# EAGLE design breakfly_rev2 (EAGLE 5.10)
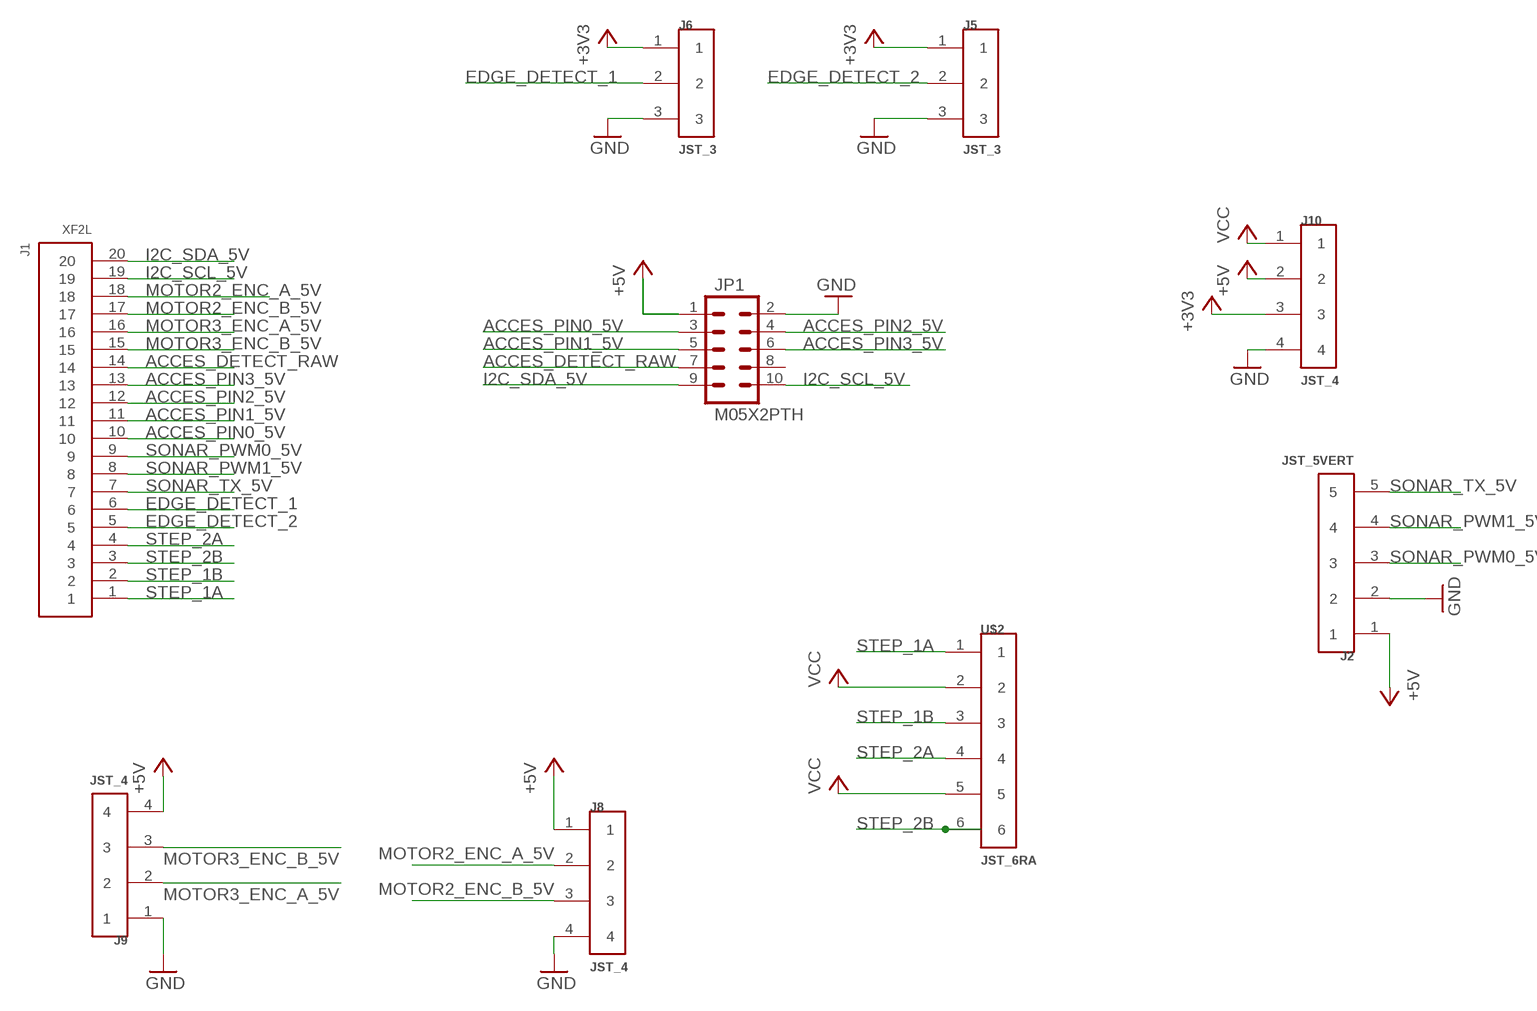
[diagram p0: schematic, sheet 1]

## Parts
J1  XF2L  [OMRON_XF]
J2  JST_5VERT  [JST_ZH_5]
J5  JST_3  [JST_ZH_3]
J6  JST_3  [JST_ZH_3]
J8  JST_4  [JST_ZH_4]
J9  JST_4  [JST_ZH_4]
J10  JST_4  [JST_ZH_4]
JP1  M05X2PTH  [AVR_ICSP]
U$2  JST_6RA  [JST_ZH_RA_6]

## Nets
+3V3: J5.1 J6.1 J10.3
+5V: J2.1 J8.1 J9.4 J10.2 JP1.1
ACCES_DETECT_RAW: J1.14 JP1.7
ACCES_PIN0_5V: J1.10 JP1.3
ACCES_PIN1_5V: J1.11 JP1.5
ACCES_PIN2_5V: J1.12 JP1.4
ACCES_PIN3_5V: J1.13 JP1.6
EDGE_DETECT_1: J1.6 J6.2
EDGE_DETECT_2: J1.5 J5.2
GND: J2.2 J5.3 J6.3 J8.4 J9.1 J10.4 JP1.2
I2C_SCL_5V: J1.19 JP1.10
I2C_SDA_5V: J1.20 JP1.9
MOTOR2_ENC_A_5V: J1.18 J8.2
MOTOR2_ENC_B_5V: J1.17 J8.3
MOTOR3_ENC_A_5V: J1.16 J9.2
MOTOR3_ENC_B_5V: J1.15 J9.3
SONAR_PWM0_5V: J1.9 J2.3
SONAR_PWM1_5V: J1.8 J2.4
SONAR_TX_5V: J1.7 J2.5
STEP_1A: J1.1 U$2.1
STEP_1B: J1.2 U$2.3
STEP_2A: J1.4 U$2.4
STEP_2B: J1.3 U$2.6
VCC: J10.1 U$2.2 U$2.5
Unconnected: JP1.8

## Library data of the parts
J1 = kwoo:XF2L
J2 = kwoo:JST_5
J5 J6 = kwoo:JST_3
J8-J10 = kwoo:JST_4
JP1 = SparkFun:M05X2: Header 5x2 Standard 10-pin dual row 0.1" header. Commonly used with AVR-ISP. Use with Spark Fun Electronics SKU: PRT-00778
U$2 = kwoo:JST_6

## Board
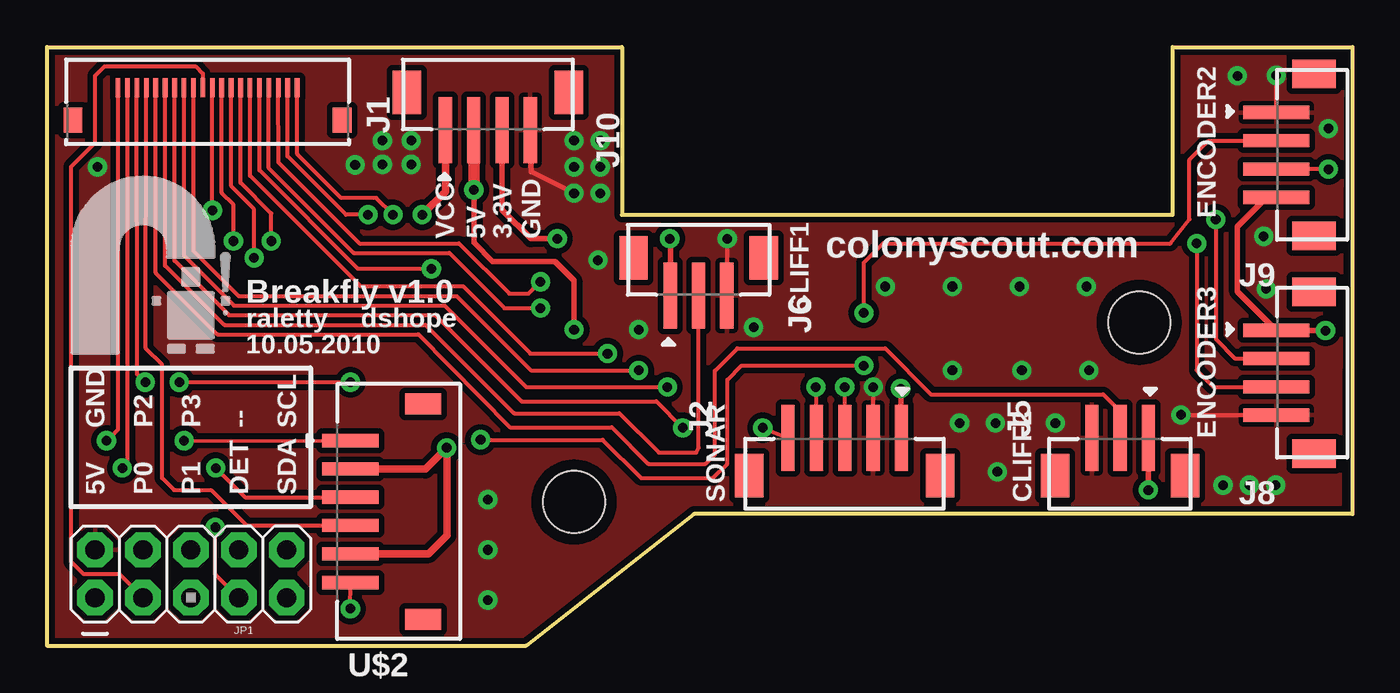
[diagram p1: board, top side]
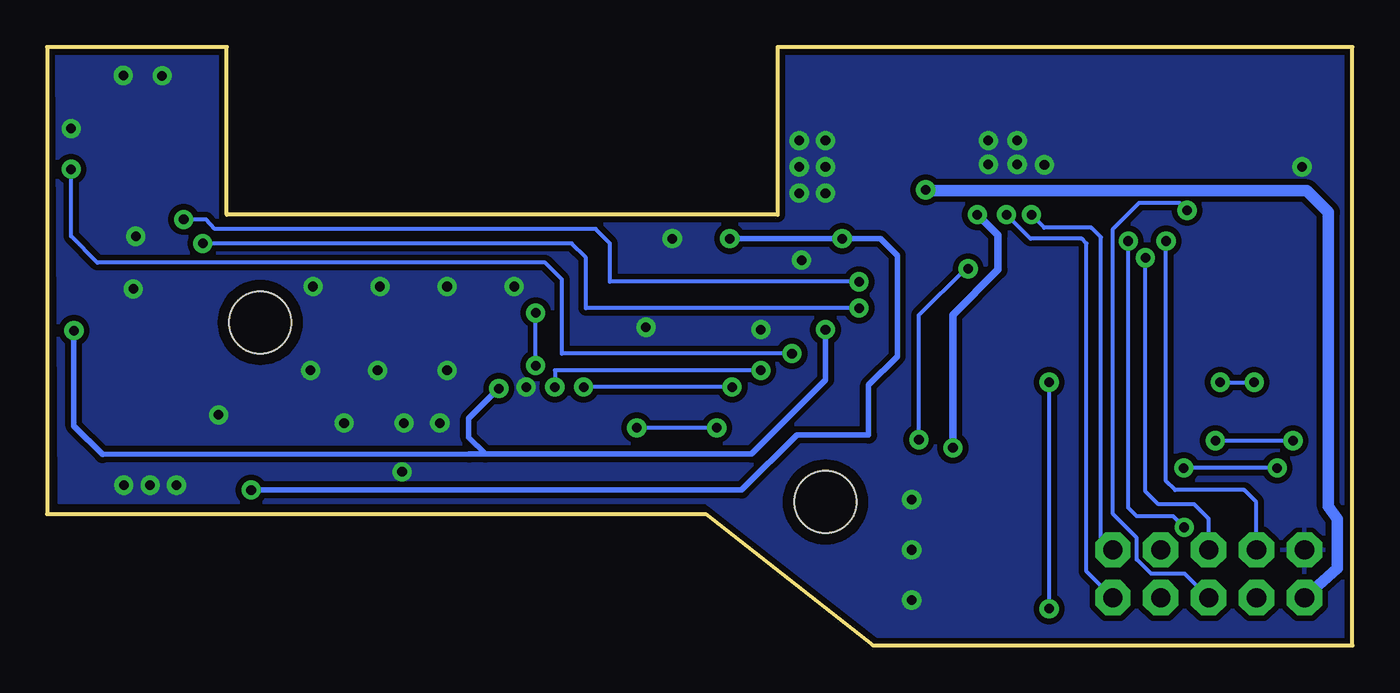
[diagram p2: board, bottom side, seen from below]

Size 69.22 x 31.75 mm. Coordinates in mm from the lower left corner, seen from the top.
Outline: 0,0 0,31.75 30.48,31.75 30.48,22.86 59.69,22.86 59.69,31.75 69.22,31.75 69.22,6.99 34.29,6.99 25.4,0 0,0
Copper layers (1*16): Top 0.035mm / dielectric 1.5mm / Bottom 0.035mm
Design rules "SparkFun": minimum track width 8mil, minimum drill 20mil, track to track 8mil, track to pad 8mil, pad to pad 8mil, via to via 8mil, smd to smd 8mil, copper to edge 10mil, drill to drill 8mil, minimum pad ring 12mil, minimum via ring 10mil, stop-mask expansion 4mil, vias tented up to drill 25mil, thermal gap 10mil

### Footprints (pad centres in the part's own frame; a part is rotated, then mirrored left to right if it is on the bottom)
OMRON_XF = smd 0.25 x 1: 1 -4.75,0; 2 -4.25,0; 3 -3.75,0; 4 -3.25,0; 5 -2.75,0; 6 -2.25,0; 7 -1.75,0; 8 -1.25,0; 9 -0.75,0; 10 -0.25,0; 11 0.25,0; 12 0.75,0; 13 1.25,0; 14 1.75,0; 15 2.25,0; 16 2.75,0; 17 3.25,0; 18 3.75,0; 19 4.25,0; 20 4.75,0 | smd 1 x 1.34: SOLDER_PAD1 -7.14,-1.72; SOLDER_PAD2 7.14,-1.72
JST_ZH_5 = smd 0.7 x 3.5: 1 -3.012,-2.508; 2 -1.512,-2.508; 3 -0.012,-2.508; 4 1.488,-2.508; 5 3.012,-2.508 | smd 1.5 x 2.3: CASE1 -5.062,-0.508; CASE2 5.062,-0.508
JST_ZH_3 = smd 0.7 x 3.5: 1 -1.5,-2; 2 0,-2; 3 1.5,-2 | smd 1.5 x 2.3: CASE1 -3.45,0; CASE2 3.45,0
JST_ZH_4 = smd 0.7 x 3.5: 1 -2.25,-2; 2 -0.75,-2; 3 0.75,-2; 4 2.25,-2 | smd 1.5 x 2.3: CASE1 -4.3,0; CASE2 4.3,0
AVR_ICSP = drill 1.016 pad 1.88 octagon: 1 -1.27,5.08; 2 1.27,5.08; 3 -1.27,2.54; 4 1.27,2.54; 5 -1.27,0; 6 1.27,0; 7 -1.27,-2.54; 8 1.27,-2.54; 9 -1.27,-5.08; 10 1.27,-5.08
STAND-OFF = hole 3.302: 0,0
JST_ZH_RA_6 = smd 0.7 x 3: 1 -3.762,-3.85; 2 -2.262,-3.85; 3 -0.762,-3.85; 4 0.738,-3.85; 5 2.238,-3.85; 6 3.762,-3.85 | smd 1.1 x 1.9: CASE1 -5.712,0; CASE2 5.712,0

### Placement (x,y rotation side)
J1  8.51,29.59 0 top
J2  42.29,8.51 180 top
J5  56.9,9.02 180 top
J6  34.54,20.57 0 top
J8  67.18,14.48 270 top
J9  67.18,26.04 270 top
J10  23.37,29.34 0 top
JP1  7.62,3.81 90 top
U$1  [STAND-OFF]  27.94,7.62 0 top
U$2  19.94,7.11 270 top
U$3  [RCLOGO]  5.08,18.54 0 top
U$4  [STAND-OFF]  57.91,17.14 0 top

### Tracks (layer width: path | path; a pad name or v marks a point on that pad's centre or on a via)
+3V3  (via drill 0.51)
  Top 0.203: J10.3 | v33.02,21.59 33.04,21.59 | J5.1
  Top 0.305: 33.04,21.59 J6.1 | v58.4,8.26 J5.1 | v27.05,21.59 25.65,21.59 24.13,23.11 24.13,27.32 J10.3
  Bottom 0.305: v33.02,21.59 v27.05,21.59 25.02,21.59 24.13,20.7 24.13,15.34 25.65,13.82 25.65,11.18 29.46,11.18 32.38,8.26 v58.4,8.26
+5V  (via drill 0.51)
  Top 0.203: 45.26,11.06 J2.1 | 22.58,27.34 J10.2 | v67.79,16.71 67.78,16.73 | 65.18,23.62 J9.4
  Top 0.305: v45.26,13.64 45.26,11.06 | 67.78,16.73 J8.1 63.12,18.79 63.12,22.23 64.52,23.62 65.18,23.62 | v22.63,24.18 22.63,21.39 23.62,20.37 26.92,20.37 27.94,19.36 v27.94,16.76
  Top 0.61: v22.63,24.18 J10.2
  Bottom 0.305: v27.94,16.76 27.94,14.1 31.88,10.16 45.97,10.16 | v67.79,16.71 67.79,11.66 66.27,10.13 46.84,10.16 45.97,10.16 | v45.26,13.64 46.86,12.04 46.86,11.05 45.97,10.16 | 22.58,24.13 v22.63,24.18
  Bottom 0.61: JP1.1 0.79,4.09 0.79,6.73 1.27,7.39 1.27,22.99 2.41,24.13 22.58,24.13
ACCES_DETECT_RAW  (via drill 0.51)
  Top 0.203: J1.14 10.26,24.56 11.89,22.93 v11.89,21.46 | v8.91,6.27 8.91,3.79 JP1.7
  Bottom 0.203: v8.91,6.27 9.5,6.86 11.43,6.86 11.89,7.32 v11.89,21.46
ACCES_PIN0_5V
  Top 0.203: JP1.3 3.81,3.81 1.91,3.81 1.27,4.45 1.27,25.4 2.54,26.67 2.54,30.23 3.05,30.73 7.87,30.73 8.26,30.35 J1.10
ACCES_PIN1_5V  (via drill 0.51)
  Top 0.203: v8.76,23.09 J1.11
  Bottom 0.203: JP1.5 8.89,3.81 10.67,3.81 11.43,4.57 11.43,5.71 12.7,6.99 12.7,22.1 11.3,23.5 9.17,23.5 v8.76,23.09
ACCES_PIN2_5V  (via drill 0.51)
  Top 0.203: JP1.4 5.11,5.11 | J1.12 9.26,24.02 9.88,23.39 v9.88,21.46
  Bottom 0.203: JP1.4 5.11,5.11 5.11,7.62 5.74,8.26 9.4,8.26 9.88,8.74 v9.88,21.46
ACCES_PIN3_5V  (via drill 0.51)
  Top 0.203: J1.13 9.76,24.36 10.97,23.15 v10.97,20.57
  Bottom 0.203: JP1.6 7.62,6.73 8.38,7.49 10.29,7.49 10.97,8.18 v10.97,20.57
EDGE_DETECT_1
  Top 0.203: J1.6 6.26,20.16 9.4,17.02 20.07,17.02 24.77,12.32 30.35,12.32 32.44,10.24 34.42,10.24 34.54,10.49 J6.2
EDGE_DETECT_2
  Top 0.203: J1.5 5.76,19.77 9.02,16.51 19.68,16.51 24.54,11.58 29.95,11.58 31.88,9.65 34.92,9.65 35.41,10.13 35.41,14.58 36.6,15.77 44.45,15.77 46.86,13.34 56.01,13.34 56.9,12.45 J5.2
GND  (via drill 0.51)
  Top 0.203: 25.65,27.34 J10.4 | J2.2 v43.81,13.72 | J6.3 v36.07,21.59 | v60.12,12.24 J8.4 | J9.1 v65.18,30.25
  Top 0.305: 25.65,27.34 25.65,25.15 v27.94,24
  other vias: 17.78,25.53 19.3,25.53 19.3,26.8 17.78,26.8 2.67,25.4 29.21,20.45 27.94,26.8 29.34,26.8 29.34,25.4 27.94,25.4 29.34,24 37.47,16.89 31.37,16.76 48.39,11.81 50.29,11.81 62.36,8.51 63.75,8.51 65.15,8.51 16.33,25.5 44.45,19.05 48.01,19.05 51.56,19.05 55.12,19.05 55.24,14.61 51.69,14.61 48.01,14.61 63.12,30.23 67.94,27.43 64.52,21.72 64.64,18.92 23.37,7.75 23.37,5.08 23.37,2.41 50.39,9.22 53.47,11.81
  pour Bottom (isolate 0.305): 0.25,31.5 30.1,31.5 30.1,22.61 59.94,22.61 60.07,31.5 68.71,31.5 68.58,7.62 34.29,7.62 25.02,0.38 0.25,0.25
  pour Top (isolate 0.305): 0.25,31.5 0.25,0.25 24.89,0.25 34.42,7.49 68.58,7.49 68.71,31.5 60.07,31.5 60.07,22.73 30.1,22.73 30.1,31.5
I2C_SCL_5V  (via drill 0.51)
  Top 0.203: J1.19 12.75,28.83 12.75,25.96 15.85,22.86 v17.02,22.86
  Bottom 0.203: JP1.10 13.34,5.71 13.34,21.67 13.84,22.17 16.33,22.17 v17.02,22.86
I2C_SDA_5V  (via drill 0.51)
  Top 0.203: J1.20 | J1.20 13.26,26.09 15.6,23.75 17.45,23.75 v18.34,22.86
  Bottom 0.203: JP1.9 14.1,3.94 14.1,21.34 14.35,21.59 17.07,21.59 v18.34,22.86
MOTOR2_ENC_A_5V  (via drill 0.51)
  Top 0.203: J1.18 12.27,25.63 16.56,21.34 21.84,21.34 24.51,18.67 25.53,18.67 v26.16,19.3 | v61.98,22.61 61.98,16.26 62.99,15.24 J8.2
  Bottom 0.203: v26.16,19.3 39.37,19.3 39.37,21.34 40.13,22.1 60.33,22.1 60.78,22.61 v61.98,22.61
MOTOR2_ENC_B_5V  (via drill 0.51)
  Top 0.203: J1.17 11.76,25.32 16.26,20.83 21.34,20.83 24.26,17.91 v26.16,17.91 | v60.96,21.34 60.96,14.61 61.85,13.72 J8.3
  Bottom 0.203: v26.16,17.91 40.64,17.91 40.64,20.57 41.4,21.34 v60.96,21.34
MOTOR3_ENC_A_5V  (via drill 0.51)
  Top 0.203: J1.16 11.26,25.21 16.48,19.99 v20.37,19.99 | v22.99,10.92 29.46,10.92 31.5,8.89 35.31,8.89 36.07,9.65 36.07,14.1 36.83,14.86 v43.31,14.86 | v43.31,17.65 43.31,20.32 44.32,21.34 59.56,21.34 60.58,22.61 60.58,25.78 61.58,26.79 J9.2
  Bottom 0.203: v22.99,10.92 22.99,17.53 20.52,19.99 v20.37,19.99 | v43.31,14.86 v43.31,17.65
MOTOR3_ENC_B_5V  (via drill 0.51)
  Top 0.203: J1.15 10.76,24.93 16.61,19.07 22.05,19.07 25.63,15.49 v29.72,15.49 | v67.94,25.27 65.18,25.27 J9.3
  Bottom 0.203: v29.72,15.49 41.91,15.49 41.91,19.43 42.8,20.32 66.55,20.32 67.94,21.72 v67.94,25.27
SONAR_PWM0_5V  (via drill 0.51)
  Top 0.203: v42.29,13.72 J2.3 | v31.37,14.61 25.65,14.61 21.72,18.54 10.16,18.54 7.76,20.94 J1.9
  Bottom 0.203: v31.37,14.61 42.29,14.61 v42.29,13.72
SONAR_PWM1_5V  (via drill 0.51)
  Top 0.203: v40.77,13.72 J2.4 | v32.89,13.72 25.4,13.72 21.08,18.03 9.91,18.03 7.26,20.68 J1.8
  Bottom 0.203: v32.89,13.72 v40.77,13.72
SONAR_TX_5V  (via drill 0.51)
  Top 0.203: v37.95,11.56 J2.5 | v33.71,11.56 32.31,12.95 25.17,12.95 20.57,17.53 9.65,17.53 6.76,20.42 J1.7
  Bottom 0.203: v33.71,11.56 v37.95,11.56
STEP_1A  (via drill 0.51)
  Top 0.203: v7.26,10.87 U$2.1 | v3.15,10.87 3.76,11.48 J1.1
  Bottom 0.203: v3.15,10.87 v7.26,10.87
STEP_1B  (via drill 0.51)
  Top 0.203: v8.94,9.42 10.49,7.87 U$2.3 | v3.99,9.42 4.26,9.7 J1.2
  Bottom 0.203: v3.99,9.42 v8.94,9.42
STEP_2A
  Top 0.203: J1.4 5.23,15.77 6.1,14.91 6.1,8.89 6.73,8.26 8.69,8.26 10.57,6.37 U$2.4
STEP_2B  (via drill 0.51)
  Top 0.203: v16.08,13.97 v7.01,13.97 | v16.08,1.96 U$2.6 | J1.3 4.78,15.37 4.78,14.4 v5.21,13.97
  Bottom 0.203: v7.01,13.97 v5.21,13.97 | v16.08,1.96 v16.08,13.97
VCC  (via drill 0.51)
  Top 0.305: 21.21,10.46 v21.18,10.49 | J10.1 21.16,27.3
  Top 0.406: v21.18,10.49 20.07,9.37 U$2.2 | 21.21,10.46 21.21,5.84 20.24,4.87 U$2.5 | v19.89,22.86 21.12,24.09 J10.1
  Bottom 0.406: v21.18,10.49 21.18,17.55 18.8,19.94 18.8,21.77 v19.89,22.86

### Text on the board
tPlace: ENCODER2 | VCC | 5V | 3.3V | GND | CLIFF1 | colonyscout.com | ENCODER3 | Breakfly v1.0 | raletty | dshope | 10.05.2010 | GND | P2 | P3 | -- | SCL | 5V | P0 | P1 | DET | SDA | SONAR | CLIFF2